# EAGLE design lights (EAGLE 5.04)
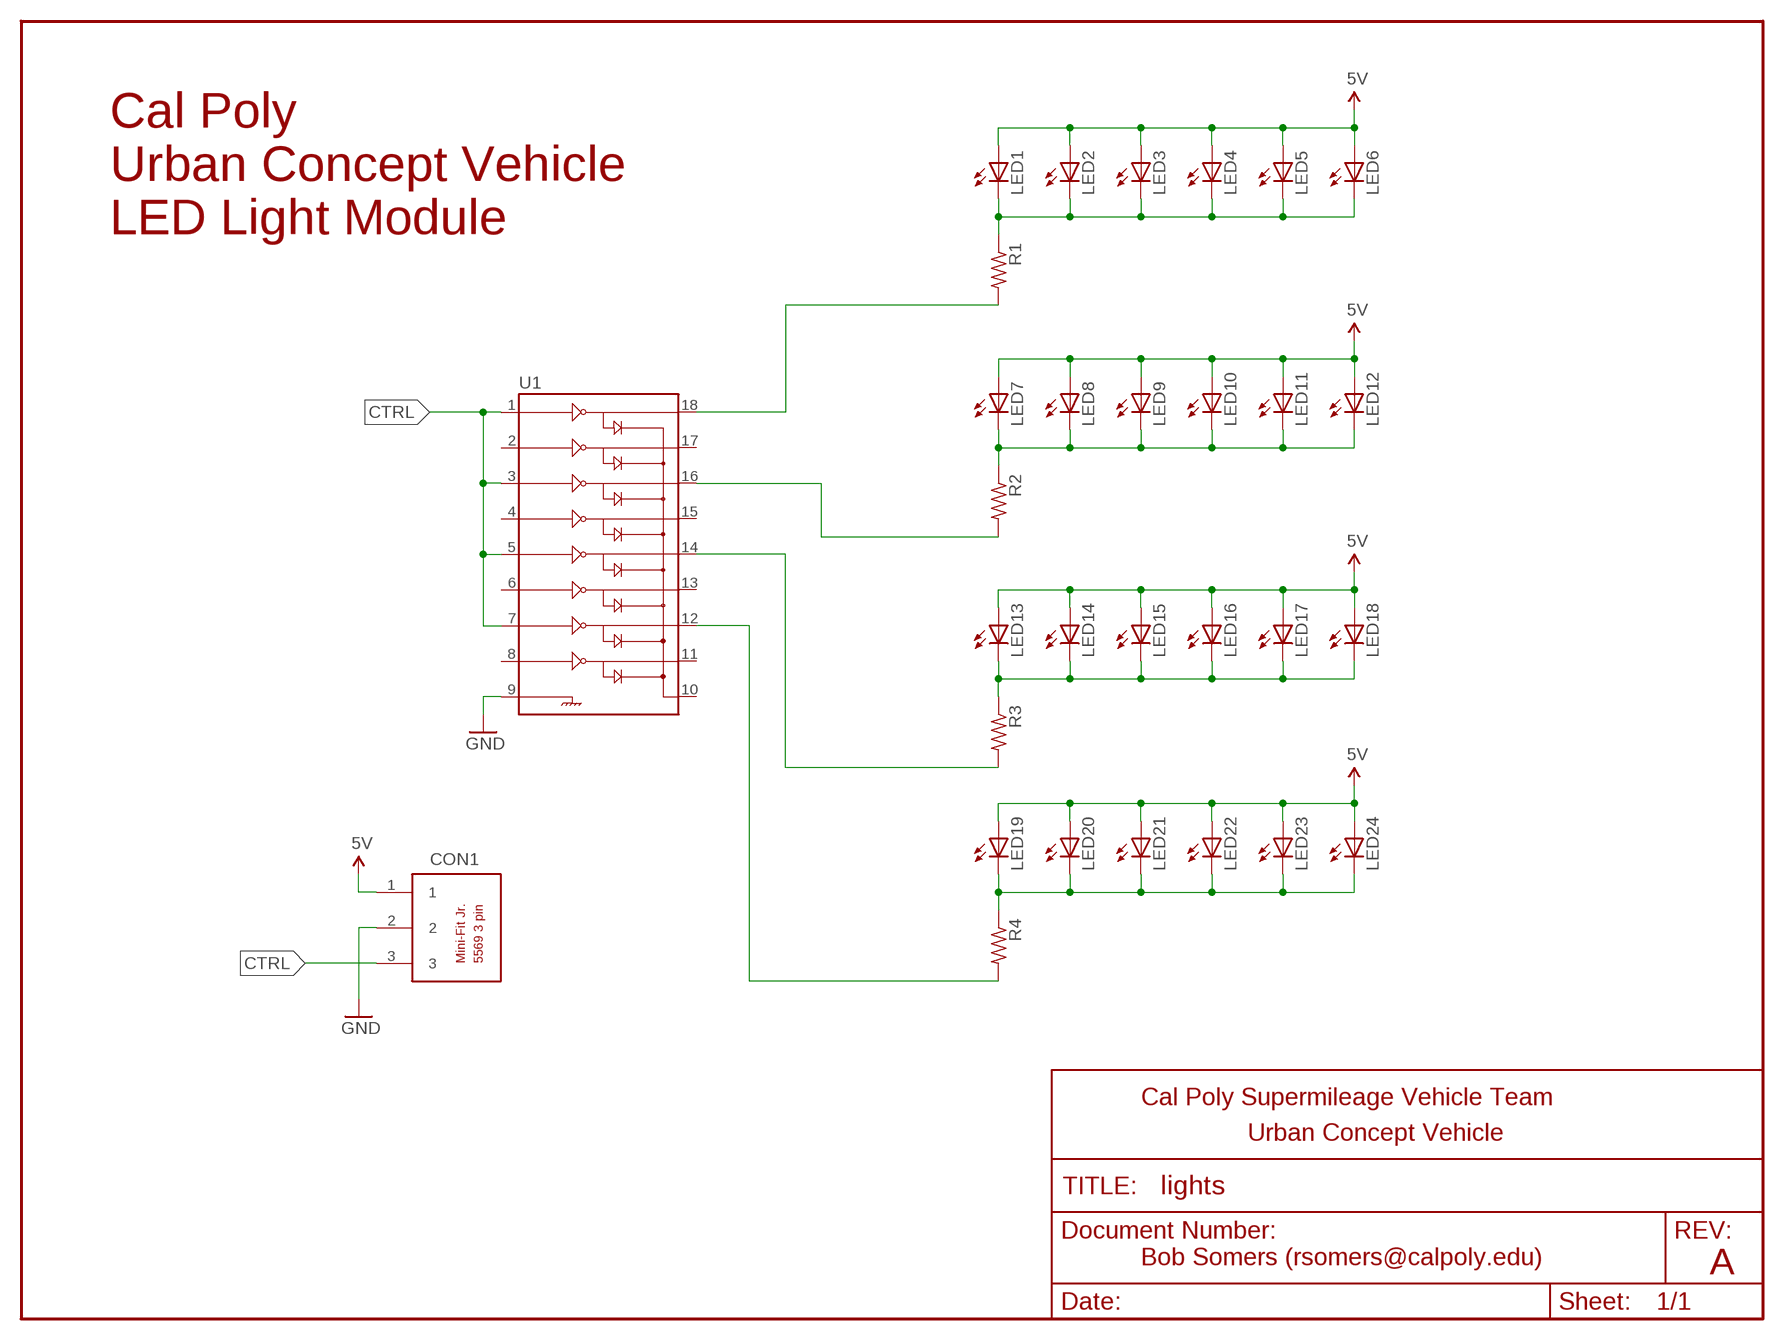
[diagram p0: schematic, sheet 1]

## Parts
CON1  MFJ-5569-3RIGHT_ANGLE  [MFJ-5569-3]
LED1  LED5MM  [LED5MM]
LED2  LED5MM  [LED5MM]
LED3  LED5MM  [LED5MM]
LED4  LED5MM  [LED5MM]
LED5  LED5MM  [LED5MM]
LED6  LED5MM  [LED5MM]
LED7  LED5MM  [LED5MM]
LED8  LED5MM  [LED5MM]
LED9  LED5MM  [LED5MM]
LED10  LED5MM  [LED5MM]
LED11  LED5MM  [LED5MM]
LED12  LED5MM  [LED5MM]
LED13  LED5MM  [LED5MM]
LED14  LED5MM  [LED5MM]
LED15  LED5MM  [LED5MM]
LED16  LED5MM  [LED5MM]
LED17  LED5MM  [LED5MM]
LED18  LED5MM  [LED5MM]
LED19  LED5MM  [LED5MM]
LED20  LED5MM  [LED5MM]
LED21  LED5MM  [LED5MM]
LED22  LED5MM  [LED5MM]
LED23  LED5MM  [LED5MM]
LED24  LED5MM  [LED5MM]
R1  R-US_0309/12  [0309/12]
R2  R-US_0309/12  [0309/12]
R3  R-US_0309/12  [0309/12]
R4  R-US_0309/12  [0309/12]
U1  ULN2803DIP  [DIL18]

## Nets
5V [Power]: CON1.1 LED1.A LED2.A LED3.A LED4.A LED5.A LED6.A LED7.A LED8.A LED9.A LED10.A LED11.A LED12.A LED13.A LED14.A LED15.A LED16.A LED17.A LED18.A LED19.A LED20.A LED21.A LED22.A LED23.A LED24.A
CTRL: CON1.3 U1.1 U1.3 U1.5 U1.7
GND [Power]: CON1.2 U1.9
N$2: LED1.K(C) LED2.K(C) LED3.K(C) LED4.K(C) LED5.K(C) LED6.K(C) R1.1
N$4: LED7.K(C) LED8.K(C) LED9.K(C) LED10.K(C) LED11.K(C) LED12.K(C) R2.1
N$6: LED13.K(C) LED14.K(C) LED15.K(C) LED16.K(C) LED17.K(C) LED18.K(C) R3.1
N$8: LED19.K(C) LED20.K(C) LED21.K(C) LED22.K(C) LED23.K(C) LED24.K(C) R4.1
N$9: R1.2 U1.18
N$10: R2.2 U1.16
N$11: R3.2 U1.14
N$12: R4.2 U1.12
Unconnected: U1.2 U1.4 U1.6 U1.8 U1.10 U1.11 U1.13 U1.15 U1.17

## Notes on the sheet
- Cal Poly
- Urban Concept Vehicle
- LED Light Module
- Cal Poly Supermileage Vehicle Team
- Urban Concept Vehicle
- Bob Somers (rsomers@calpoly.edu)
- A

## Library data of the parts
CON1 = CalPolyUCV:MFJ-5569-3
LED1-LED24 = SparkFun:LED: LEDs Standard schematic elements and footprints for 5mm, 3mm, 1206, and 0603 sized LEDs. 5mm - Spark Fun Electronics SKU : COM-00529 (and others)
R1-R4 = rcl:R-US_: RESISTOR, American symbol
U1 = SparkFun:ULN2803: Darlington Driver ULN2803 Darlington array. 500mA max per channel, 8-channel package. Spark Fun Electronics SKU : COM-00312

## Net classes
0 Signal: width 0.508 mm
1 Power: width 1.27 mm

## Board
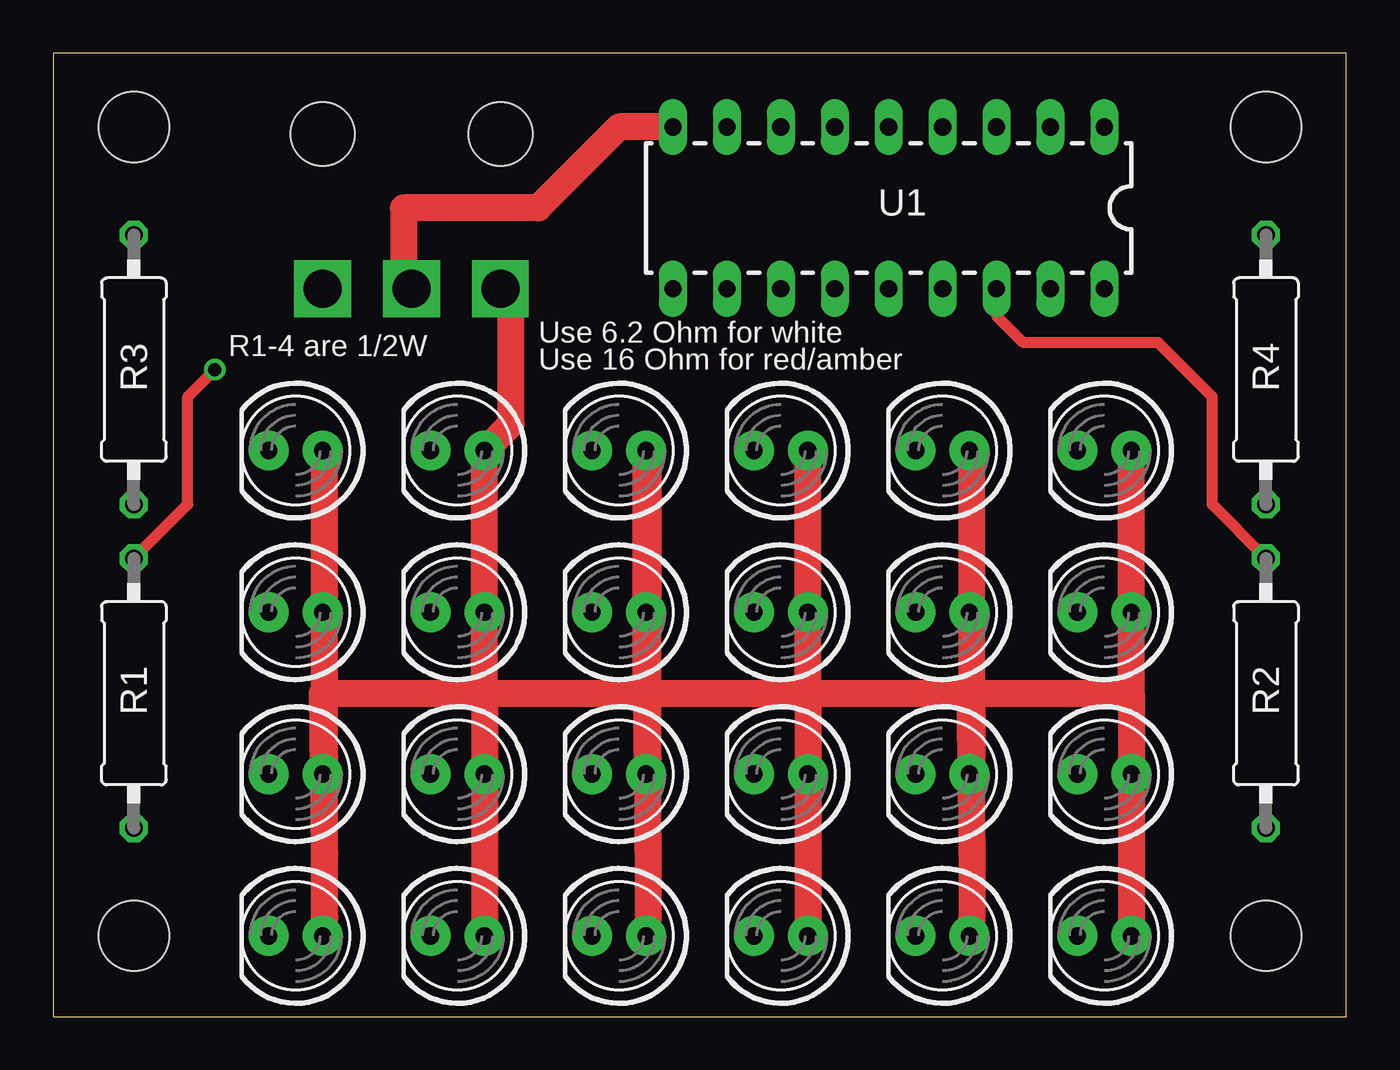
[diagram p1: board, top side]
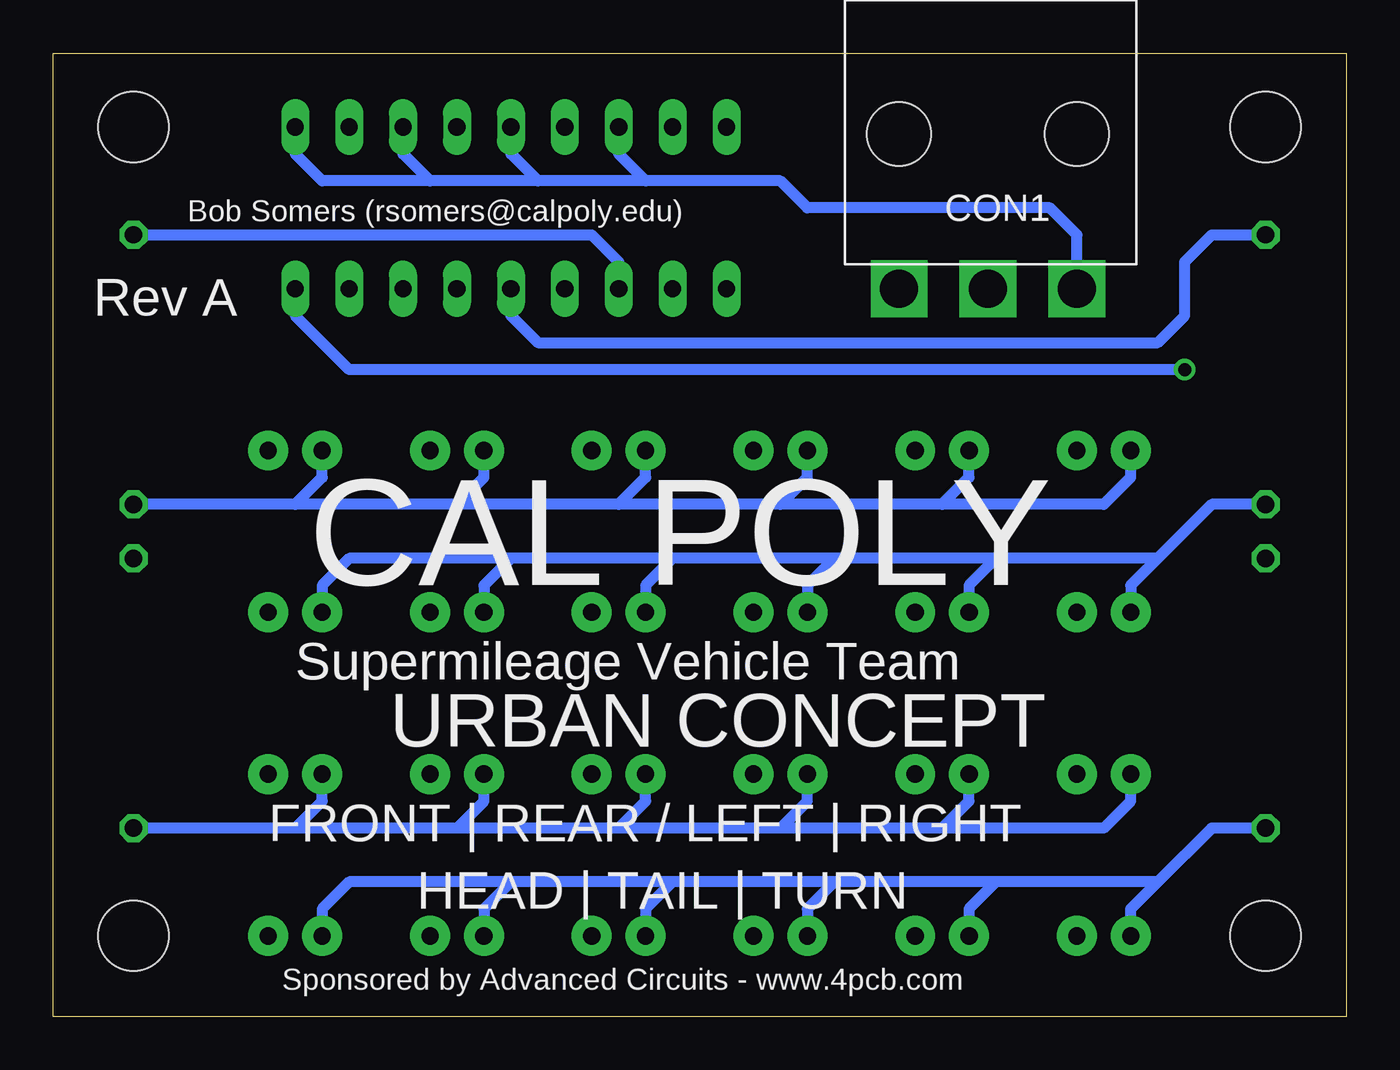
[diagram p2: board, bottom side, seen from below]

Size 60.94 x 45.39 mm. Coordinates in mm from the lower left corner, seen from the top.
Outline: 0,0 60.94,0 60.94,45.39 0,45.39 0,0
Copper layers (1*16): Top 0.035mm / dielectric 1.5mm / Bottom 0.035mm
Design rules "default *": minimum track width 10mil, minimum drill 15mil, track to track 8mil, track to pad 8mil, pad to pad 8mil, via to via 8mil, smd to smd 8mil, copper to edge 40mil, drill to drill 8mil, minimum pad ring 10mil, minimum via ring 8mil, stop-mask expansion 4mil, vias tented up to drill 0mil, thermal gap 10mil

### Footprints (pad centres in the part's own frame; a part is rotated, then mirrored left to right if it is on the bottom)
MFJ-5569-3 = drill 1.778 pad 2.54 square: 1 8.382,0; 2 4.191,0; 3 0,0 | hole 2.997: 0,-7.29; 8.382,-7.29
LED5MM = drill 0.813 pad 1.88 round: A -1.27,0; K 1.27,0
0309/12 = drill 0.813 octagon: 1 -6.35,0; 2 6.35,0
DIL18 = drill 0.813 long: 1 -10.16,-3.81; 2 -7.62,-3.81; 3 -5.08,-3.81; 4 -2.54,-3.81; 5 0,-3.81; 6 2.54,-3.81; 7 5.08,-3.81; 8 7.62,-3.81; 9 10.16,-3.81; 10 10.16,3.81; 11 7.62,3.81; 12 5.08,3.81; 13 2.54,3.81; 14 0,3.81; 15 -2.54,3.81; 16 -5.08,3.81; 17 -7.62,3.81; 18 -10.16,3.81
STAND-OFF = hole 3.302: 0,0

### Placement (x,y rotation side)
CON1  12.7,34.29 180 bottom
LED1  11.43,3.81 180 top
LED2  19.05,3.81 180 top
LED3  26.67,3.81 180 top
LED4  34.29,3.81 180 top
LED5  41.91,3.81 180 top
LED6  49.53,3.81 180 top
LED7  11.43,11.43 180 top
LED8  19.05,11.43 180 top
LED9  26.67,11.43 180 top
LED10  34.29,11.43 180 top
LED11  41.91,11.43 180 top
LED12  49.53,11.43 180 top
LED13  11.43,19.05 180 top
LED14  19.05,19.05 180 top
LED15  26.67,19.05 180 top
LED16  34.29,19.05 180 top
LED17  41.91,19.05 180 top
LED18  49.53,19.05 180 top
LED19  11.43,26.67 180 top
LED20  19.05,26.67 180 top
LED21  26.67,26.67 180 top
LED22  34.29,26.67 180 top
LED23  41.91,26.67 180 top
LED24  49.53,26.67 180 top
R1  3.81,15.24 90 top
R2  57.15,15.24 90 top
R3  3.81,30.48 90 top
R4  57.15,30.48 90 top
U1  39.37,38.1 180 top
U$6  [STAND-OFF]  3.81,3.81 0 top
U$7  [STAND-OFF]  3.81,41.91 0 top
U$8  [STAND-OFF]  57.15,41.91 0 top
U$9  [STAND-OFF]  57.15,3.81 0 top

### Tracks (layer width: path | path; a pad name or v marks a point on that pad's centre or on a via)
5V
  Top 1.27: 43.28,7.72 43.28,10.57 LED11.A 43.28,12.19 43.28,15.24 | 43.28,7.72 43.28,4.67 LED5.A | LED23.A 43.28,25.81 43.28,19.91 LED17.A 43.28,18.29 43.28,15.24 | LED6.A LED12.A 50.8,15.24 | LED24.A LED18.A 50.8,15.24 | 28.04,7.72 28.04,10.57 LED9.A 28.04,12.19 28.04,18.29 LED15.A 28.04,19.91 28.04,25.81 LED21.A 27.94,15.24 | 28.04,7.72 28.04,4.67 LED3.A | LED22.A LED16.A 35.56,15.24 | 35.56,15.24 LED10.A LED4.A 35.56,15.24 | 12.8,7.72 12.8,10.57 LED7.A 12.8,12.19 12.8,18.29 LED13.A 12.8,19.91 12.8,25.81 LED19.A | 12.8,7.72 12.8,4.67 LED1.A | LED2.A LED8.A 20.32,15.24 | 20.32,15.24 LED14.A LED20.A 21.59,27.94 21.59,34.29 CON1.1 | 12.8,7.72 12.7,15.24 20.32,15.24 | 20.32,15.24 27.94,15.24 | 27.94,15.24 28.04,7.72 | 27.94,15.24 35.56,15.24 | 35.56,15.24 43.18,15.24 | 43.18,15.24 43.28,15.24 | 43.18,15.24 43.28,7.72 | 43.18,15.24 50.8,15.24
CTRL
  Bottom 0.508: CON1.3 12.7,36.83 13.97,38.1 25.4,38.1 26.67,39.37 33.02,39.37 | 33.02,39.37 38.1,39.37 | 38.1,39.37 43.18,39.37 | 43.18,39.37 48.26,39.37 49.53,40.64 U1.1 | U1.3 44.45,40.64 43.18,39.37 | U1.5 39.37,40.64 38.1,39.37 | U1.7 34.29,40.64 33.02,39.37
GND
  Top 1.27: U1.9 26.67,41.91 22.86,38.1 16.51,38.1 16.51,34.67 CON1.2
N$2
  Bottom 0.508: R1.1 6.35,8.89 8.89,6.35 | 8.89,6.35 16.51,6.35 | 16.51,6.35 24.13,6.35 | 24.13,6.35 31.75,6.35 | 31.75,6.35 39.37,6.35 | 39.37,6.35 46.99,6.35 48.26,5.08 LED6.K | LED5.K 40.64,5.08 39.37,6.35 | LED4.K 33.02,5.08 31.75,6.35 | LED3.K 25.4,5.08 24.13,6.35 | LED2.K 17.78,5.08 16.51,6.35 | LED1.K 10.16,5.08 8.89,6.35
N$4
  Bottom 0.508: 19.05,8.89 11.43,8.89 10.16,10.16 LED7.K | 19.05,8.89 26.67,8.89 | 26.67,8.89 34.29,8.89 | 34.29,8.89 41.91,8.89 | 41.91,8.89 49.53,8.89 | 49.53,8.89 R2.1 | LED8.K 17.78,10.16 19.05,8.89 | LED9.K 25.4,10.16 26.67,8.89 | LED10.K 33.02,10.16 34.29,8.89 | LED11.K 40.64,10.16 41.91,8.89 | LED12.K 48.26,10.16 49.53,8.89
N$6
  Bottom 0.508: R3.1 6.35,24.13 8.89,21.59 | 8.89,21.59 16.51,21.59 | 16.51,21.59 24.13,21.59 | 24.13,21.59 31.75,21.59 | 31.75,21.59 39.37,21.59 | 39.37,21.59 46.99,21.59 48.26,20.32 LED18.K | LED17.K 40.64,20.32 39.37,21.59 | LED16.K 33.02,20.32 31.75,21.59 | LED15.K 25.4,20.32 24.13,21.59 | LED14.K 17.78,20.32 16.51,21.59 | LED13.K 10.16,20.32 8.89,21.59
N$8
  Bottom 0.508: 19.05,24.13 11.43,24.13 10.16,25.4 LED19.K | 19.05,24.13 26.67,24.13 | 26.67,24.13 34.29,24.13 | 34.29,24.13 41.91,24.13 | 41.91,24.13 49.53,24.13 | 49.53,24.13 R4.1 | LED20.K 17.78,25.4 19.05,24.13 | LED21.K 25.4,25.4 26.67,24.13 | LED22.K 33.02,25.4 34.29,24.13 | LED23.K 40.64,25.4 41.91,24.13 | LED24.K 48.26,25.4 49.53,24.13
N$9  (via drill 0.6)
  Top 0.508: R1.2 6.35,24.13 6.35,29.21 v7.62,30.48
  Bottom 0.508: v7.62,30.48 46.99,30.48 49.53,33.02 U1.18
N$10
  Top 0.508: R2.2 54.61,24.13 54.61,29.21 52.07,31.75 45.72,31.75 44.45,33.02 U1.16
N$11
  Bottom 0.508: U1.14 39.37,33.02 38.1,31.75 8.89,31.75 7.62,33.02 7.62,35.56 6.35,36.83 R3.2
N$12
  Bottom 0.508: R4.2 35.56,36.83 34.29,35.56 U1.12

### Text on the board
tPlace: Use 6.2 Ohm for white | R1-4 are 1/2W | Use 16 Ohm for red/amber
bPlace: Bob Somers (rsomers@calpoly.edu) | Rev A | CAL POLY | Supermileage Vehicle Team | URBAN CONCEPT | FRONT | REAR / LEFT | RIGHT | HEAD | TAIL | TURN | Sponsored by Advanced Circuits - www.4pcb.com